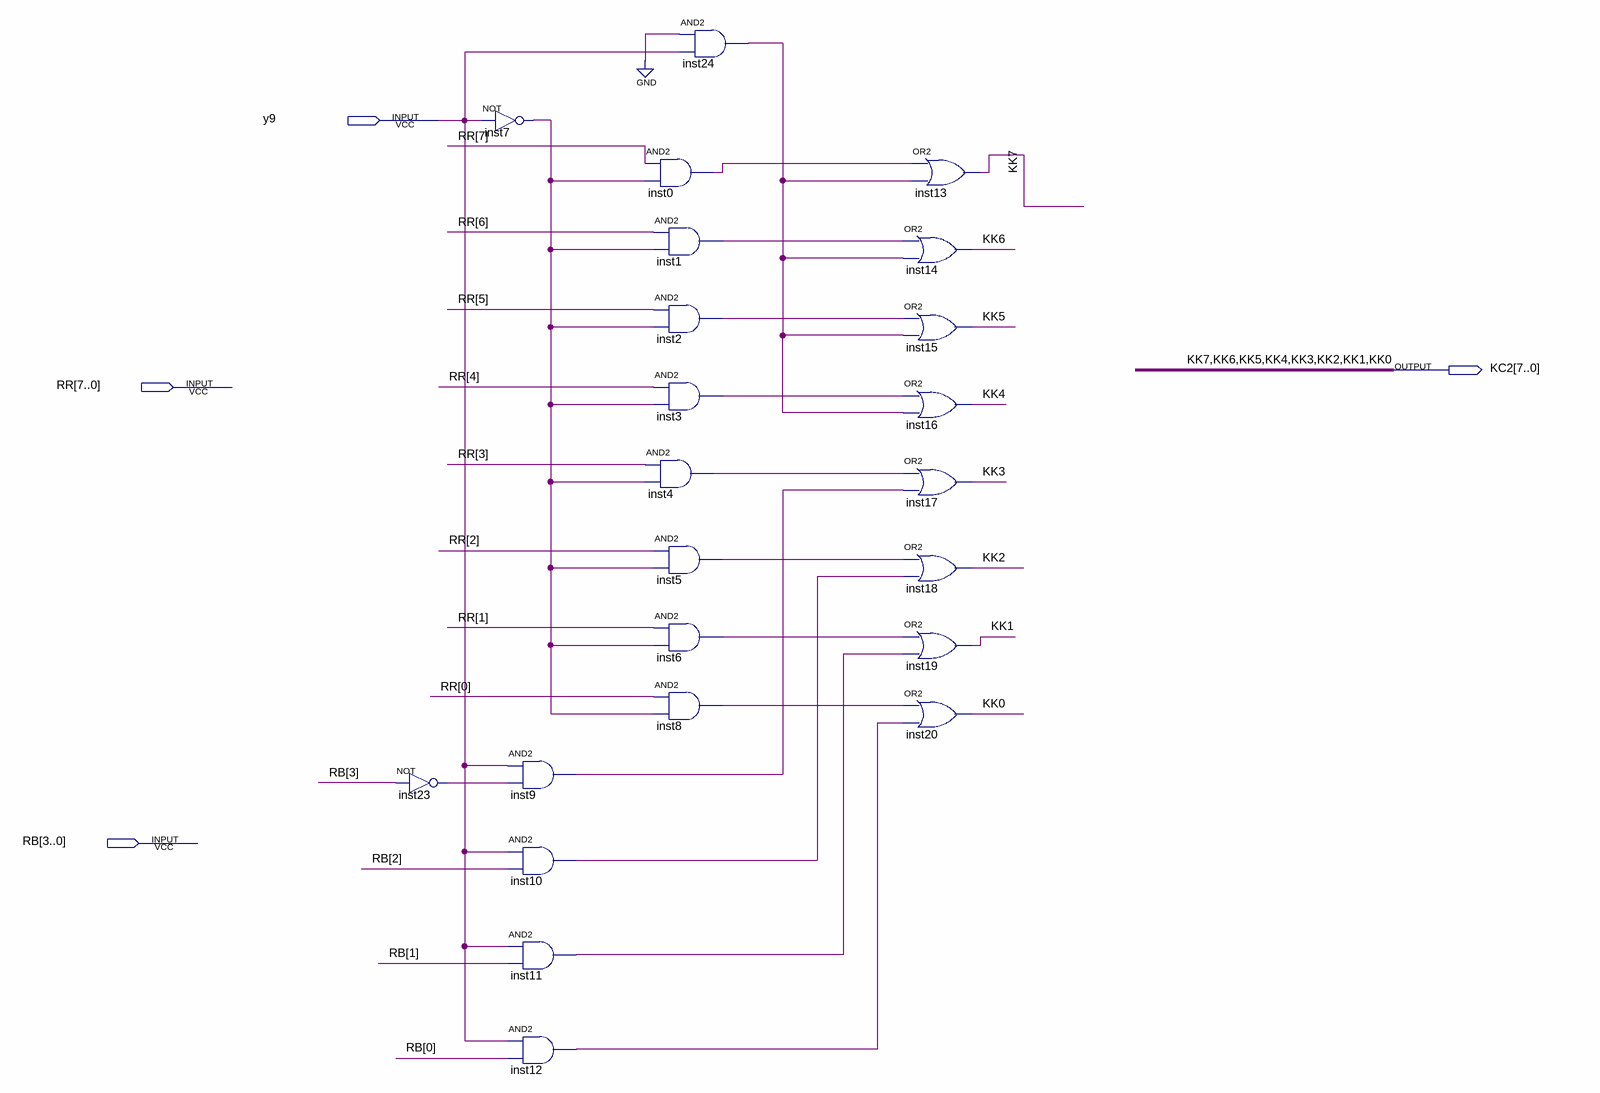
[diagram p0: schematic sheet]
// Quartus schematic KC2.bdf as structural Verilog: 23 symbols, 4 pins
module KC2 (
  input  y9,
  input  [7:0] RR,
  input  [3:0] RB,
  output [7:0] KC2
);

  wire inst0_out, inst1_out, inst2_out, inst3_out, inst4_out, inst5_out, inst6_out, inst7_out, inst8_out,
       inst9_out, inst10_out, inst11_out, inst12_out, inst23_out, inst24_out;

  not inst23 (inst23_out, RB[3]);
  not inst7 (inst7_out, y9);
  and inst9 (inst9_out, y9, inst23_out);
  and inst10 (inst10_out, y9, RB[2]);
  and inst11 (inst11_out, y9, RB[1]);
  and inst12 (inst12_out, y9, RB[0]);
  and inst0 (inst0_out, RR[7], inst7_out);
  and inst1 (inst1_out, RR[6], inst7_out);
  and inst2 (inst2_out, RR[5], inst7_out);
  and inst3 (inst3_out, RR[4], inst7_out);
  and inst4 (inst4_out, RR[3], inst7_out);
  and inst5 (inst5_out, RR[2], inst7_out);
  and inst6 (inst6_out, RR[1], inst7_out);
  and inst8 (inst8_out, RR[0], inst7_out);
  and inst24 (inst24_out, 1'b0, y9);
  or inst13 (KC2[7], inst0_out, inst24_out);
  or inst14 (KC2[6], inst1_out, inst24_out);
  or inst15 (KC2[5], inst2_out, inst24_out);
  or inst16 (KC2[4], inst3_out, inst24_out);
  or inst17 (KC2[3], inst4_out, inst9_out);
  or inst18 (KC2[2], inst5_out, inst10_out);
  or inst19 (KC2[1], inst6_out, inst11_out);
  or inst20 (KC2[0], inst8_out, inst12_out);

  // Other names for the same wires on the sheet: KK0 = KC2[0]; KK1 = KC2[1]; KK2 = KC2[2]; KK3 = KC2[3]; KK4 = KC2[4];
  //   KK5 = KC2[5]; KK6 = KC2[6]; KK7 = KC2[7]
endmodule
